# Altium schematic sheet Sheet1.SchDoc
size A1; SheetNumber: 1; SheetTotal: 1
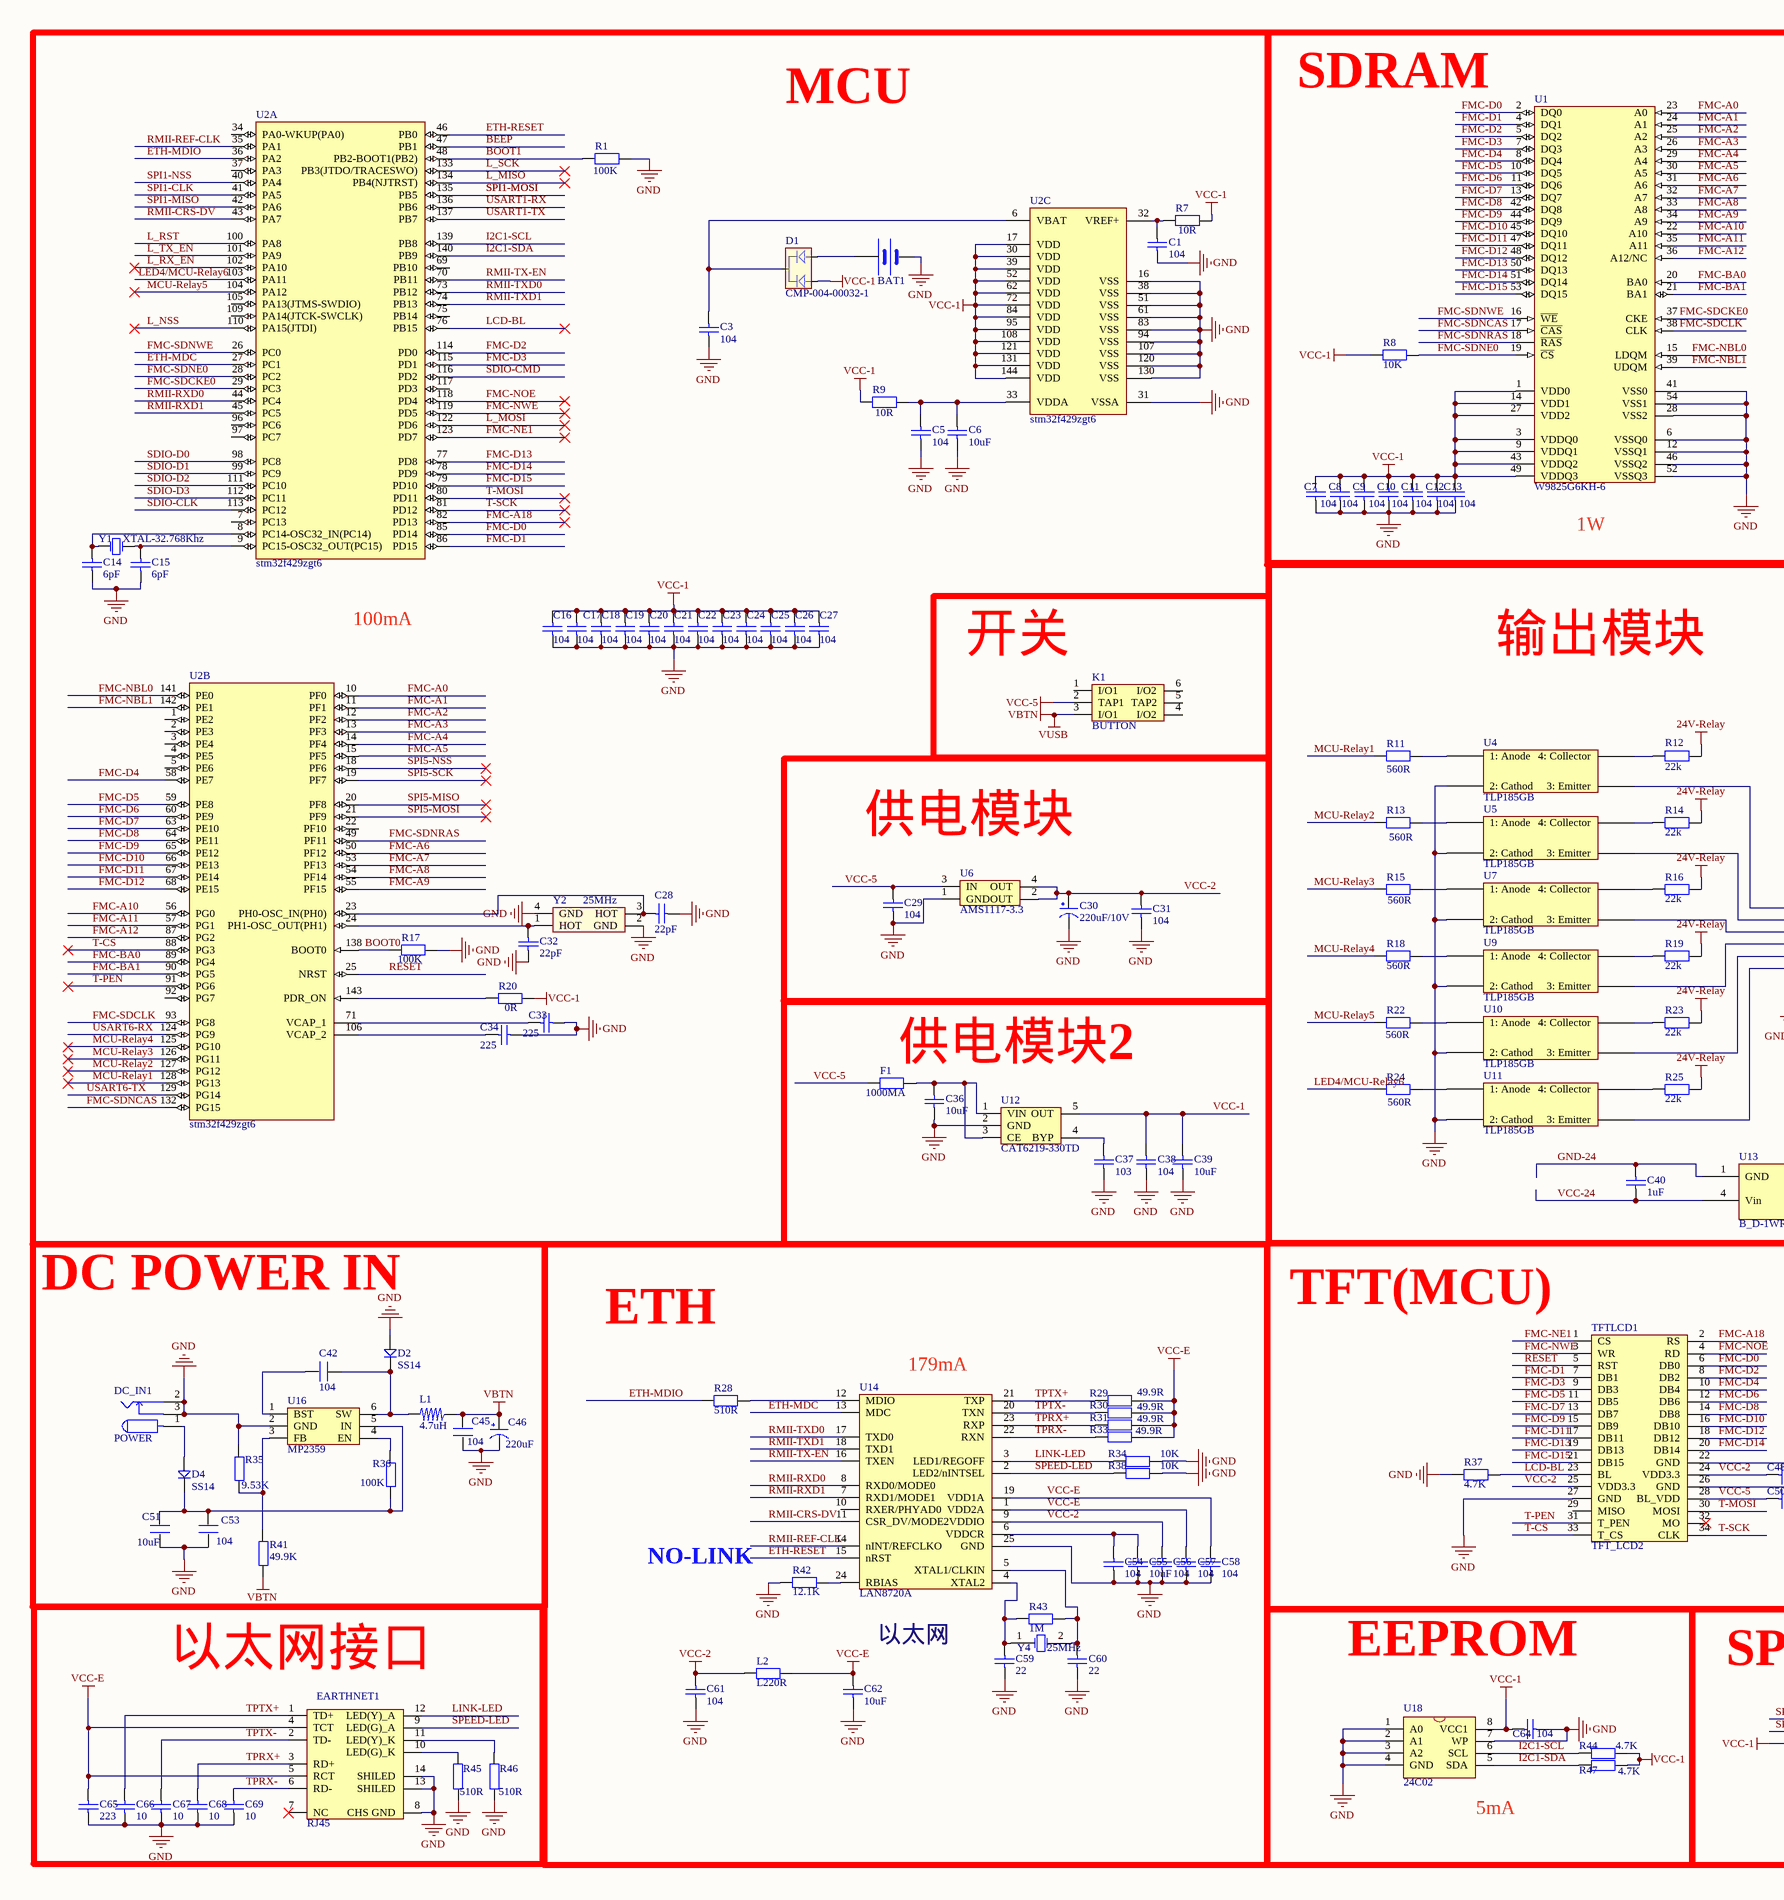
[diagram p0: Sheet1.SchDoc, left]
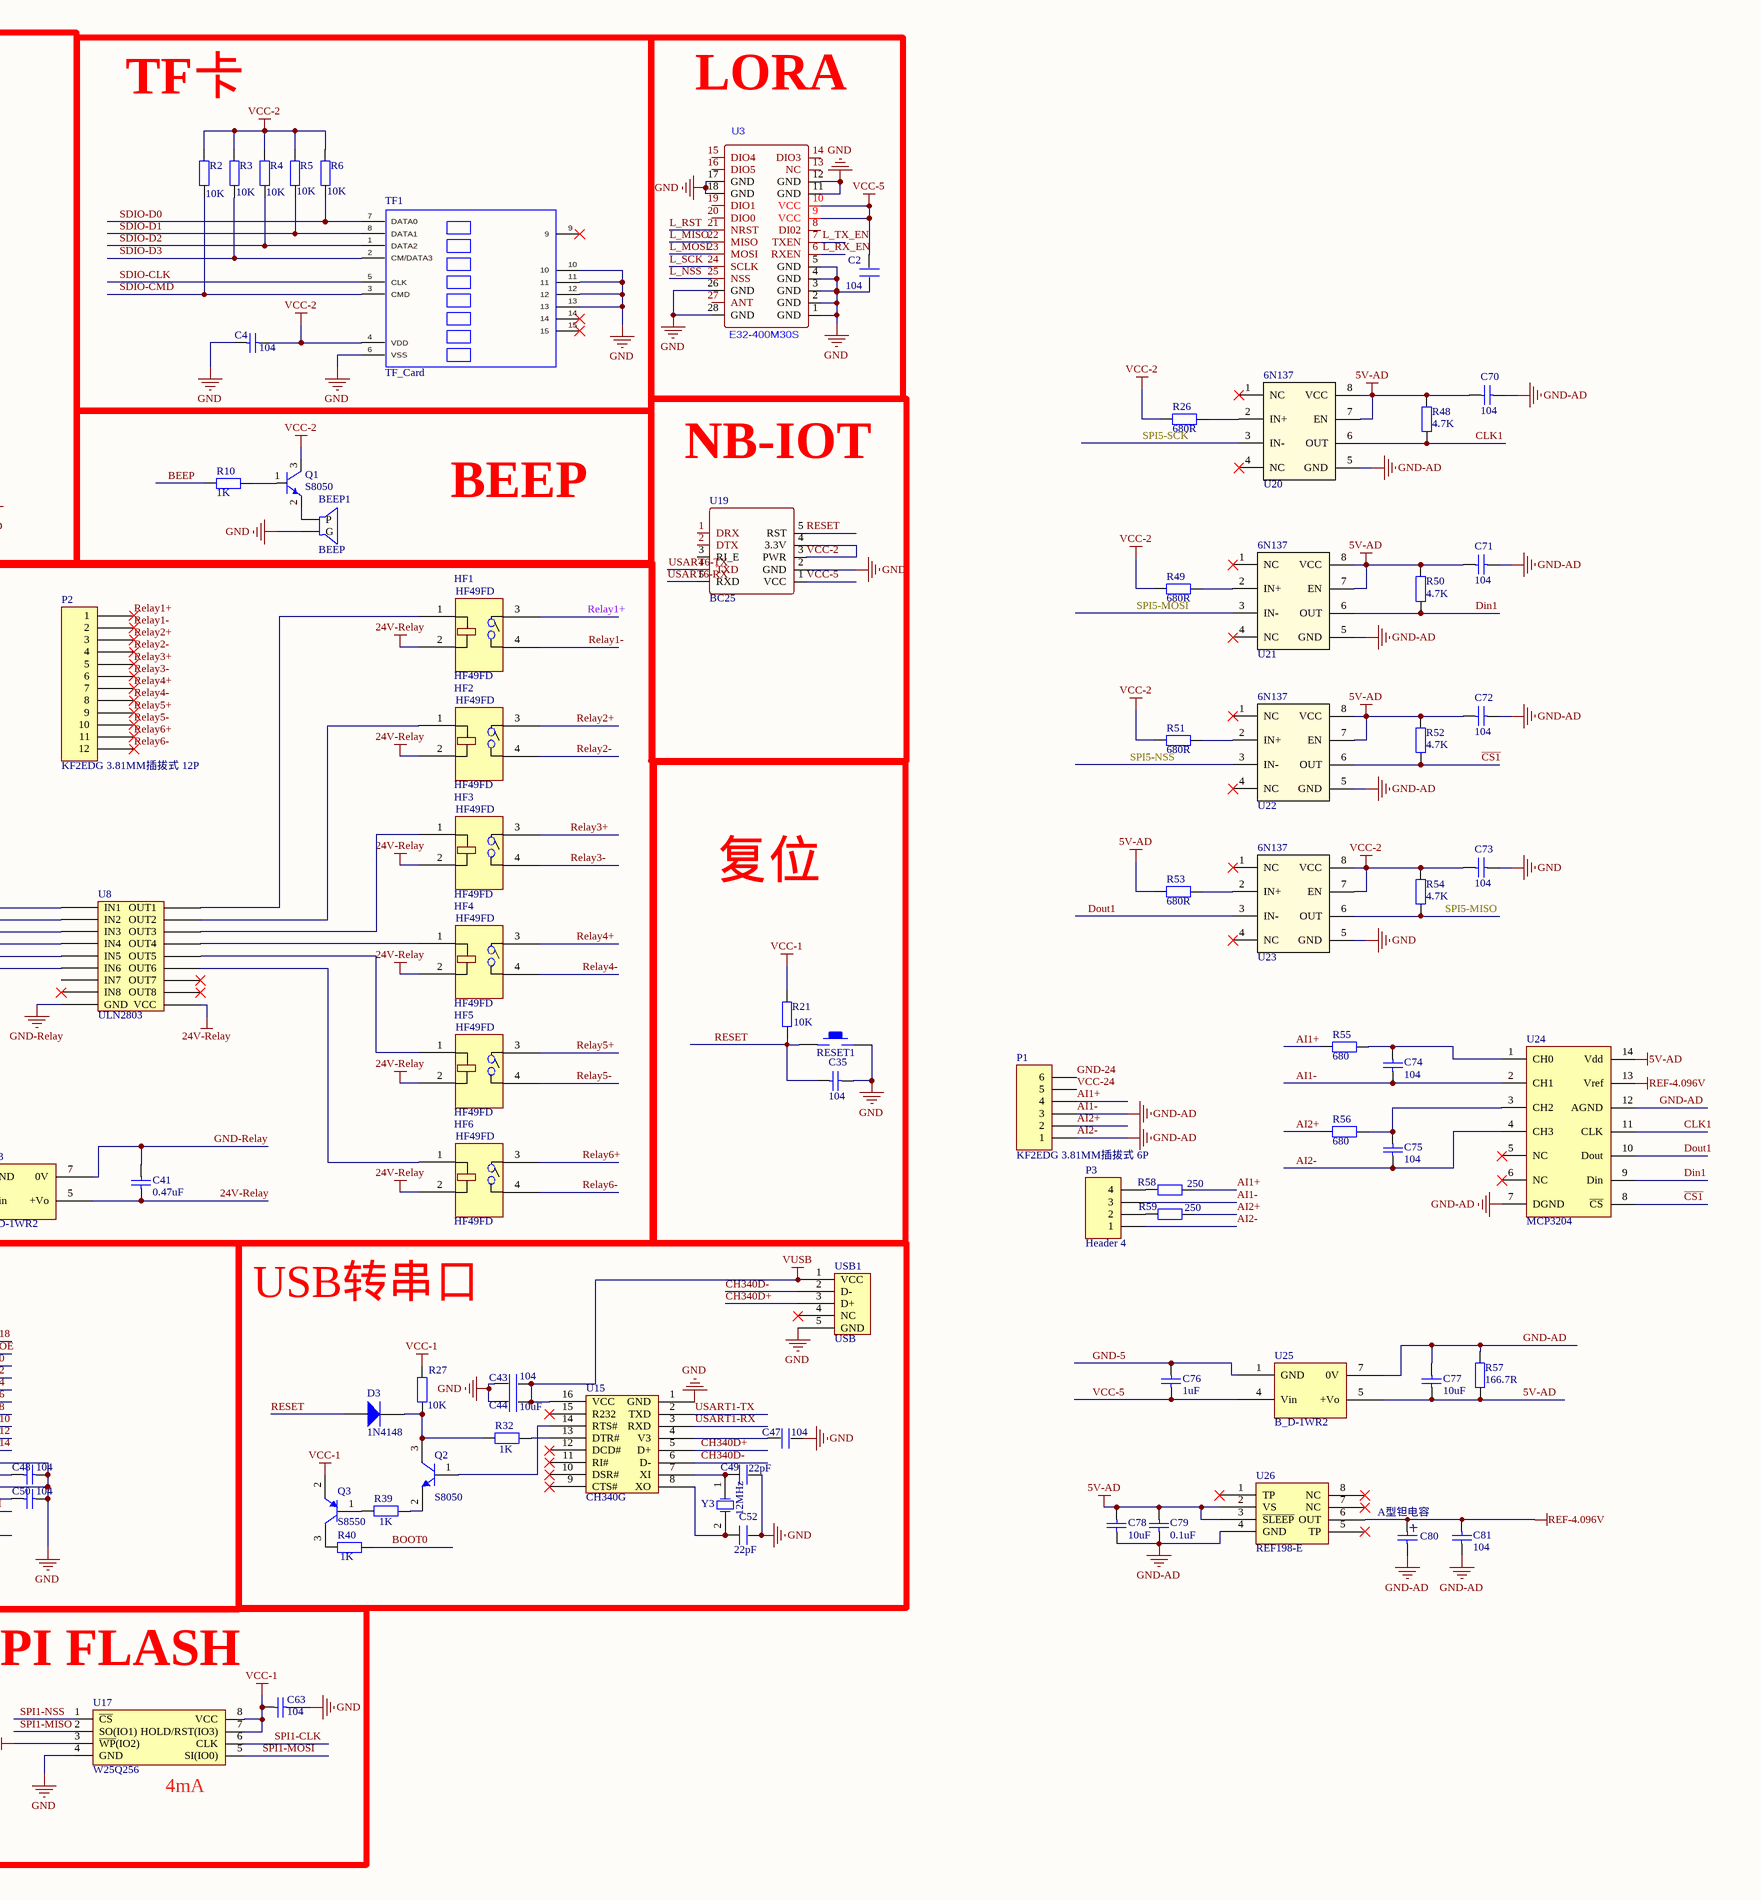
[diagram p1: Sheet1.SchDoc, right]

## Parts
BAT1  CMP-00029-00001-1  [BATM]  (value not drawn)
BEEP1  BEEP  [BELL-5]
C1  value 104  [LC-0603_C]  (hidden comment: CAP)
C2  104  [0603P]
C3  value 104  [LC-0603_C]  (hidden comment: CAP)
C4  value 104  [CAP]  (hidden comment: CMP-001-00083-1)
C5  value 104  [LC-0603_C]  (hidden comment: CAP)
C6  value 10uF  [LC-0603_C]  (hidden comment: CMP-001-00083-1)
C7  value 104  [LC-0603_C]  (hidden comment: CAP)
C8  value 104  [LC-0603_C]  (hidden comment: CAP)
C9  value 104  [LC-0603_C]  (hidden comment: CAP)
C10  value 104  [LC-0603_C]  (hidden comment: CAP)
C11  value 104  [LC-0603_C]  (hidden comment: CAP)
C12  value 104  [LC-0603_C]  (hidden comment: CAP)
C13  value 104  [LC-0603_C]  (hidden comment: CAP)
C14  value 6pF  [LC-0603_C]  (hidden comment: CMP-001-00083-1)
C15  value 6pF  [LC-0603_C]  (hidden comment: CMP-001-00083-1)
C16  value 104  [LC-0603_C]  (hidden comment: CMP-001-00083-1)
C17  value 104  [LC-0603_C]  (hidden comment: CMP-001-00083-1)
C18  value 104  [LC-0603_C]  (hidden comment: CAP)
C19  value 104  [LC-0603_C]  (hidden comment: CAP)
C20  value 104  [LC-0603_C]  (hidden comment: CAP)
C21  value 104  [LC-0603_C]  (hidden comment: CAP)
C22  value 104  [LC-0603_C]  (hidden comment: CAP)
C23  value 104  [LC-0603_C]  (hidden comment: CAP)
C24  104  [LC-0603_C]
C25  value 104  [LC-0603_C]  (hidden comment: CAP)
C26  value 104  [LC-0603_C]  (hidden comment: CAP)
C27  value 104  [LC-0603_C]  (hidden comment: CAP)
C28  value 22pF  [LC-0603_C]  (hidden comment: CMP-001-00083-1)
C29  value 104  [CAP]  (hidden comment: CMP-001-00083-1)
C30  220uF/10V  [220uF/10V]
C31  value 104  [CAP]  (hidden comment: CMP-001-00083-1)
C32  value 22pF  [LC-0603_C]  (hidden comment: CMP-001-00083-1)
C33  value 225  [LC-0603_C]  (hidden comment: CMP-001-00083-1)
C34  value 225  [LC-0603_C]  (hidden comment: CMP-001-00083-1)
C35  value 104  [LC-0603_C]  (hidden comment: CAP)
C36  value 10uF  [LC-0603_C]  (hidden comment: CMP-001-00083-1)
C37  value 103  [CAP]  (hidden comment: CMP-001-00083-1)
C38  value 104  [CAP]  (hidden comment: CMP-001-00083-1)
C39  value 10uF  [LC-0603_C]  (hidden comment: CMP-001-00083-1)
C40  value 1uF  [CAP]  (hidden comment: CMP-001-00083-1)
C41  value 0.47uF  [CAP]  (hidden comment: CMP-001-00083-1)
C42  104  [0603P]
C43  104  [0603P]
C44  10uF  [0603P]
C45  104  [0603P]
C46  220uF  [CC6.56.5]
C47  104  [0603P]
C48  value 104  [CAP]  (hidden comment: CMP-001-00083-1)
C49  22pF  [0603P]
C50  value 104  [CAP]  (hidden comment: CMP-001-00083-1)
C51  10uF  [0603P]
C52  22pF  [0603P]
C53  104  [0603P]
C54  value 104  [LC-0603_C]  (hidden comment: CAP)
C55  value 10uF  [LC-0603_C]  (hidden comment: CMP-001-00083-1)
C56  value 104  [LC-0603_C]  (hidden comment: CAP)
C57  value 104  [LC-0603_C]  (hidden comment: CAP)
C58  value 104  [LC-0603_C]  (hidden comment: CAP)
C59  value 22  [LC-0603_C]  (hidden comment: CMP-001-00083-1)
C60  value 22  [LC-0603_C]  (hidden comment: CMP-001-00083-1)
C61  value 104  [CAP]  (hidden comment: CMP-001-00083-1)
C62  value 10uF  [LC-0603_C]  (hidden comment: CMP-001-00083-1)
C63  value 104  [CAP]  (hidden comment: CMP-001-00083-1)
C64  value 104  [CAP]  (hidden comment: CMP-001-00083-1)
C65  value 223  [CAP]  (hidden comment: CMP-001-00083-1)
C66  value 10  [CAP]  (hidden comment: CMP-001-00083-1)
C67  value 10  [CAP]  (hidden comment: CMP-001-00083-1)
C68  value 10  [CAP]  (hidden comment: CMP-001-00083-1)
C69  value 10  [CAP]  (hidden comment: CMP-001-00083-1)
C70  value 104  [CAP]  (hidden comment: CAP)
C71  value 104  [CAP]  (hidden comment: CAP)
C72  value 104  [CAP]  (hidden comment: CAP)
C73  value 104  [CAP]  (hidden comment: CAP)
C74  value 104  [CAP]  (hidden comment: CAP)
C75  value 104  [CAP]  (hidden comment: CAP)
C76  value 1uF  [CAP]  (hidden comment: CMP-001-00083-1)
C77  value 10uF  [CAP]  (hidden comment: CMP-001-00083-1)
C78  value 10uF  [CAP]  (hidden comment: CAP)
C79  value 0.1uF  [CAP]  (hidden comment: CAP)
C80  A型钽电容  [A型贴片钽电容]
C81  value 104  [CAP]  (hidden comment: CAP)
D1  CMP-004-00032-1  [SOT-23]
D2  SS14  [DIODE_3*5.3]
D3  1N4148  [3.2X1.6X1.1]
D4  SS14  [DIODE_3*5.3]
DC_IN1  POWER  [DC10B]
EARTHNET1  RJ45  [HR911105A]
F1  value 1000MA  [RES]  (hidden comment: CMP-009-00177-1)
HF1  HF49FD  [HF49FDXXX_1HX1]
HF2  HF49FD  [HF49FDXXX_1HX1]
HF3  HF49FD  [HF49FDXXX_1HX1]
HF4  HF49FD  [HF49FDXXX_1HX1]
HF5  HF49FD  [HF49FDXXX_1HX1]
HF6  HF49FD  [HF49FDXXX_1HX1]
K1  BUTTON  [BTN8.5*8.5]
L1  4.7uH  [L_SOP74]
L2  L220R  [RES]
P1  KF2EDG 3.81MM插拔式 6P  [KF2EDG 3.81MM拔插]
P2  KF2EDG 3.81MM插拔式 12P  [KF2EDG 3.81mm插拔式]
P3  Header 4  [HDR1X4]
Q1  S8050  [NPN/PNP]
Q2  S8050  [SOT-23_N]
Q3  S8550  [SOT-23B_N]
R1  value 100K  [LC-0603_R]  (hidden comment: CMP-009-00177-1)
R2  10K  [RES]
R3  10K  [RES]
R4  10K  [RES]
R5  10K  [RES]
R6  10K  [RES]
R7  value 10R  [LC-0603_R]  (hidden comment: CMP-009-00177-1)
R8  10K  [LC-0603_R]
R9  value 10R  [LC-0603_R]  (hidden comment: CMP-009-00177-1)
R10  1K  [RES]
R11  value 560R  [RES]  (hidden comment: RES)
R12  value 22k  [RES]  (hidden comment: CMP-009-00180-1)
R13  value 560R  [RES]  (hidden comment: RES)
R14  value 22k  [RES]  (hidden comment: CMP-009-00180-1)
R15  value 560R  [RES]  (hidden comment: RES)
R16  value 22k  [RES]  (hidden comment: CMP-009-00180-1)
R17  value 100K  [LC-0603_R]  (hidden comment: CMP-009-00177-1)
R18  value 560R  [RES]  (hidden comment: RES)
R19  value 22k  [RES]  (hidden comment: CMP-009-00180-1)
R20  value 0R  [RES]  (hidden comment: CMP-009-00177-1)
R21  10K  [LC-0603_R]
R22  value 560R  [RES]  (hidden comment: RES)
R23  value 22k  [RES]  (hidden comment: CMP-009-00180-1)
R24  value 560R  [RES]  (hidden comment: RES)
R25  value 22k  [RES]  (hidden comment: CMP-009-00180-1)
R26  value 680R  [RES]  (hidden comment: RES)
R27  10K  [0805R]
R28  510R  [LC-0603_R]
R29  49.9R  [LC-0603_R]
R30  49.9R  [LC-0603_R]
R31  49.9R  [LC-0603_R]
R32  1K  [0805R]
R33  49.9R  [LC-0603_R]
R34  10K  [LC-0603_R]
R35  9.53K  [0603P]
R36  100K  [0603P]
R37  value 4.7K  [RES]  (hidden comment: CMP-009-00180-1)
R38  10K  [LC-0603_R]
R39  1K  [0805R]
R40  1K  [0805R]
R41  49.9K  [0603P]
R42  12.1K  [LC-0603_R]
R43  1M  [LC-0603_R]
R44  value 4.7K  [RES]  (hidden comment: CMP-009-00180-1)
R45  510R  [RES]
R46  510R  [RES]
R47  4.7K  [RES]
R48  value 4.7K  [RES]  (hidden comment: RES)
R49  value 680R  [RES]  (hidden comment: RES)
R50  value 4.7K  [RES]  (hidden comment: RES)
R51  value 680R  [RES]  (hidden comment: RES)
R52  value 4.7K  [RES]  (hidden comment: RES)
R53  value 680R  [RES]  (hidden comment: RES)
R54  value 4.7K  [RES]  (hidden comment: RES)
R55  value 680  [RES]  (hidden comment: RES)
R56  value 680  [RES]  (hidden comment: RES)
R57  value 166.7R  [1206_R]  (hidden comment: CMP-009-00180-1)
R58  value 250  [1206_R]  (hidden comment: CMP-009-00180-1)
R59  value 250  [1206_R]  (hidden comment: CMP-009-00180-1)
RESET1  CMP-012-000013-1  [KEY_M]  (value not drawn)
TF1  TF_Card  [TF_CARD]
TFTLCD1  TFT_LCD2  [DB2*17-3.5]
U1  W9825G6KH-6  [TSOP54]
U2  stm32f429zgt6  [STM-LQFP144_N]  (parts A,B,C of 3)
U3  E32-400M30S  [WIRELM-SMD_E32-400M30S]
U4  TLP185GB  [TLP185GB]
U5  TLP185GB  [TLP185GB]
U6  AMS1117-3.3  [AMS1117]
U7  TLP185GB  [TLP185GB]
U8  ULN2803  [ULN2803]
U9  TLP185GB  [TLP185GB]
U10  TLP185GB  [TLP185GB]
U11  TLP185GB  [TLP185GB]
U12  CAT6219-330TD  [SOT-23-5]
U13  B_D-1WR2  [B_D-1WR2]
U14  LAN8720A  [QFN24]
U15  CH340G  [CH340]
U16  MP2359  [SOT-23-6]
U17  W25Q256  [WSON8]
U18  24C02  [SOP-8]
U19  BC25  [BC28]
U20  6N137  [6N137]  (value not drawn)
U21  6N137  [6N137]  (value not drawn)
U22  6N137  [6N137]  (value not drawn)
U23  6N137  [6N137]  (value not drawn)
U24  MCP3204  [MCP3204]
U25  B_D-1WR2  [B_D-1WR2]
U26  REF198-E  [REF198]
USB1  USB  [USB-mirco]
Y1  XTAL-32.768Khz  [XTAL3215]
Y2  25MHz  [XTAL3225]
Y3  12MHz  [插针二脚晶振]
Y4  25MHz  [XTAL_US]

## Blocks framed on the sheet
MCU: BAT1 C1 C3 C5 C6 C14-C28 C32-C34 D1 R1 R7 R9 R17 R20 U2 Y1 Y2
SDRAM: C7-C13 R8 U1
TF卡: C4 R2-R6 TF1
LORA: C2 U3
NB-IOT: U19
BEEP: BEEP1 Q1 R10
输出模块: C40 C41 HF1-HF6 P2 R11-R16 R18 R19 R22-R25 U4 U5 U7-U11 U13
开关: K1
供电模块: C29-C31 U6
复位: C35 R21 RESET1
供电模块2: C36-C39 F1 U12
DC POWER IN: C42 C45 C46 C51 C53 D2 D4 DC_IN1 L1 R35 R36 R41 U16
ETH: C54-C62 L2 R28-R31 R33 R34 R38 R42 R43 U14 Y4
TFT(MCU): C48 C50 R37 TFTLCD1
USB转串口: C43 C44 C47 C49 C52 D3 Q2 Q3 R27 R32 R39 R40 U15 USB1 Y3
以太网接口: C65-C69 EARTHNET1 R45 R46
EEPROM: C64 R44 R47 U18
SPI FLASH: C63 U17

## Nets
5V-AD: C70.1 C71.1 C72.1 C77.1 C78.2 C79.2 R48.2 R50.2 R52.2 R53.1 R57.1 U20.7(EN) U20.8(VCC) U21.7(EN) U21.8(VCC) U22.7(EN) U22.8(VCC) U24.14(Vdd) U25.5(+Vo) U26.2(VS) U26.3(~{SLEEP})
24V-Relay: C41.1 HF1.2 HF2.2 HF3.2 HF4.2 HF5.2 HF6.2 R12.2 R14.2 R16.2 R19.2 R23.2 R25.2 U8.10(VCC) U13.5(+Vo)
AI1-: C70.2 C71.2 C72.2 C74.1 C75.1 C77.2 C78.1 C79.1 C80.2 C81.1 P1.1 P1.3 P3.1 P3.3 R57.2 U20.5(GND) U21.5(GND) U22.5(GND) U24.2(CH1) U24.4(CH3) U24.7(DGND) U24.12(AGND) U25.7(0V) U26.4(GND)  [also labelled AI2-, GND-AD]
GND: BAT1.2(GND) BEEP1.2(G) C1.1 C2.1 C3.1 C4.1 C5.1 C6.1 C7.1 C8.1 C9.1 C10.1 C11.1 C12.1 C13.1 C14.1 C15.1 C16.1 C17.1 C18.1 C19.1 C20.1 C21.1 C22.1 C23.1 C24.1 C25.1 C26.1 C27.1 C28.1 C29.1 C30.2(GND) C31.1 C32.1 C33.1 C34.1 C35.2 C36.1 C37.1 C38.1 C39.1 C43.1 C44.1 C45.1 C46.2(GND) C47.2 C48.2 C49.1 C50.2 C51.1 C52.1 C53.1 C54.1 C55.1 C56.1 C57.1 C58.1 C59.1 C60.1 C61.1 C62.1 C63.2 C64.2 C65.1 C66.1 C67.1 C68.1 C69.1 C73.2 D2.1 DC_IN1.2 DC_IN1.3 EARTHNET1.8(CHS_GND) EARTHNET1.13(SHILED) EARTHNET1.14(SHILED) R1.1 R17.2 R34.2 R35.2 R37.1 R38.2 R42.1 R45.1 R46.1 RESET1.2 TF1.6(VSS) TF1.10 TF1.11 TF1.12 TF1.13 TFTLCD1.22(GND) TFTLCD1.26(GND) TFTLCD1.27(GND) U1.6(VSSQ0) U1.12(VSSQ1) U1.28(VSS2) U1.41(VSS0) U1.46(VSSQ2) U1.52(VSSQ3) U1.54(VSS1) U2.16(VSS) U2.31(VSSA) U2.38(VSS) U2.51(VSS) U2.61(VSS) U2.83(VSS) U2.94(VSS) U2.107(VSS) U2.120(VSS) U2.130(VSS) U3.1(GND) U3.2(GND) U3.3(GND) U3.4(GND) U3.5(GND) U3.11(GND) U3.12(GND) U3.17(GND) U3.18(GND) U3.26(GND) U3.28(GND) U4.2(2:_Cathod) U5.2(2:_Cathod) U6.1(GND) U7.2(2:_Cathod) U9.2(2:_Cathod) U10.2(2:_Cathod) U11.2(2:_Cathod) U12.2(GND) U14.25(GND) U15.1(GND) U16.2(GND) U17.4(GND) U18.1(A0) U18.2(A1) U18.3(A2) U18.4(GND) U18.7(WP) U19.2(GND) U23.5(GND) USB1.5(GND) Y2.2(GND) Y2.4(GND)
GND-Relay: C41.2 U8.9(GND) U13.7(0V)
REF-4.096V: C80.1 C81.2 U24.13(Vref) U26.6(OUT)
VBTN: C43.2 C44.2 C45.2 C46.1(VCC) K1.3(I/O1) L1.1 R41.1 U15.16(VCC) USB1.1(VCC)  [also labelled VUSB]
VCC-1: C7.2 C8.2 C9.2 C10.2 C11.2 C12.2 C13.2 C16.2 C17.2 C18.2 C19.2 C20.2 C21.2 C22.2 C23.2 C24.2 C25.2 C26.2 C27.2 C38.2 C39.2 C63.1 C64.1 D1.1 Q3.2(E) R7.2 R8.1 R9.1 R20.1 R21.2 R27.2 R44.2 R47.2 U1.1(VDD0) U1.3(VDDQ0) U1.9(VDDQ1) U1.14(VDD1) U1.27(VDD2) U1.43(VDDQ2) U1.49(VDDQ3) U2.17(VDD) U2.30(VDD) U2.39(VDD) U2.52(VDD) U2.62(VDD) U2.72(VDD) U2.84(VDD) U2.95(VDD) U2.108(VDD) U2.121(VDD) U2.131(VDD) U2.144(VDD) U12.5(OUT) U17.3(~{WP}(IO2)) U17.7(HOLD/RST(IO3)) U17.8(VCC) U18.8(VCC1)
VCC-2: C4.2 C30.1(VCC) C31.2 C48.1 C56.2 C61.2 C73.1 L2.1 Q1.3 R2.2 R3.2 R4.2 R5.2 R6.2 R26.1 R49.1 R51.1 R54.2 TF1.4(VDD) TFTLCD1.24(VDD3.3) TFTLCD1.25(VDD3.3) U6.2(OUT) U6.4(OUT) U14.9(VDDIO) U19.3(PWR) U19.4(3.3V) U23.7(EN) U23.8(VCC)
VCC-5: C2.2 C29.2 C50.1 C76.1 F1.1 K1.2(TAP1) TFTLCD1.28(BL_VDD) U3.9(VCC) U3.10(VCC) U6.3(IN) U19.1(VCC) U25.4(Vin)
VCC-E: C57.2 C58.2 C62.2 C65.2 EARTHNET1.4(TCT) EARTHNET1.5(RCT) L2.2 R29.2 R30.2 R31.2 R33.2 U14.1(VDD2A) U14.19(VDD1A)
AI1+: P1.4 R55.1 R58.1
AI2+: P1.2 R56.1 R59.1
BEEP: R10.1 U2.47(PB1)
BOOT0: R17.1 R40.1 U2.138(BOOT0)
BOOT1: R1.2 U2.48(PB2-BOOT1(PB2))
~{CS1}: R52.1 U22.6(OUT) U24.8(~{CS})
CH340D+: U15.5(D+) USB1.3(D+)
CH340D-: U15.6(D-) USB1.2(D-)
CLK1: R48.1 U20.6(OUT) U24.11(CLK)
Din1: R50.1 U21.6(OUT) U24.9(Din)
Dout1: U23.3(IN-) U24.10(Dout)
ETH-MDC: U2.27(PC1) U14.13(MDC)
ETH-MDIO: R28.1 U2.36(PA2)
ETH-RESET: U2.46(PB0) U14.15(nRST)
FMC-A0: U1.23(A0) U2.10(PF0)
FMC-A1: U1.24(A1) U2.11(PF1)
FMC-A2: U1.25(A2) U2.12(PF2)
FMC-A3: U1.26(A3) U2.13(PF3)
FMC-A4: U1.29(A4) U2.14(PF4)
FMC-A5: U1.30(A5) U2.15(PF5)
FMC-A6: U1.31(A6) U2.50(PF12)
FMC-A7: U1.32(A7) U2.53(PF13)
FMC-A8: U1.33(A8) U2.54(PF14)
FMC-A9: U1.34(A9) U2.55(PF15)
FMC-A10: U1.22(A10) U2.56(PG0)
FMC-A11: U1.35(A11) U2.57(PG1)
FMC-A12: U1.36(A12/NC) U2.87(PG2)
FMC-A18: TFTLCD1.2(RS) U2.82(PD13)
FMC-BA0: U1.20(BA0) U2.89(PG4)
FMC-BA1: U1.21(BA1) U2.90(PG5)
FMC-D0: TFTLCD1.6(DB0) U1.2(DQ0) U2.85(PD14)
FMC-D1: TFTLCD1.7(DB1) U1.4(DQ1) U2.86(PD15)
FMC-D2: TFTLCD1.8(DB2) U1.5(DQ2) U2.114(PD0)
FMC-D3: TFTLCD1.9(DB3) U1.7(DQ3) U2.115(PD1)
FMC-D4: TFTLCD1.10(DB4) U1.8(DQ4) U2.58(PE7)
FMC-D5: TFTLCD1.11(DB5) U1.10(DQ5) U2.59(PE8)
FMC-D6: TFTLCD1.12(DB6) U1.11(DQ6) U2.60(PE9)
FMC-D7: TFTLCD1.13(DB7) U1.13(DQ7) U2.63(PE10)
FMC-D8: TFTLCD1.14(DB8) U1.42(DQ8) U2.64(PE11)
FMC-D9: TFTLCD1.15(DB9) U1.44(DQ9) U2.65(PE12)
FMC-D10: TFTLCD1.16(DB10) U1.45(DQ10) U2.66(PE13)
FMC-D11: TFTLCD1.17(DB11) U1.47(DQ11) U2.67(PE14)
FMC-D12: TFTLCD1.18(DB12) U1.48(DQ12) U2.68(PE15)
FMC-D13: TFTLCD1.19(DB13) U1.50(DQ13) U2.77(PD8)
FMC-D14: TFTLCD1.20(DB14) U1.51(DQ14) U2.78(PD9)
FMC-D15: TFTLCD1.21(DB15) U1.53(DQ15) U2.79(PD10)
FMC-NBL0: U1.15(LDQM) U2.141(PE0)
FMC-NBL1: U1.39(UDQM) U2.142(PE1)
FMC-NE1: TFTLCD1.1(CS) U2.123(PD7)
FMC-NOE: TFTLCD1.4(RD) U2.118(PD4)
FMC-NWE: TFTLCD1.3(WR) U2.119(PD5)
FMC-SDCKE0: U1.37(CKE) U2.29(PC3)
FMC-SDCLK: U1.38(CLK) U2.93(PG8)
FMC-SDNCAS: U1.17(~{CAS}) U2.132(PG15)
FMC-SDNE0: R8.2 U1.19(~{CS}) U2.28(PC2)
FMC-SDNRAS: U1.18(~{RAS}) U2.49(PF11)
FMC-SDNWE: U1.16(~{WE}) U2.26(PC0)
GND-5: C76.2 U25.1(GND)
GND-24: C40.2 P1.6 U13.1(GND)
I2C1-SCL: R44.1 U2.139(PB8) U18.6(SCL)
I2C1-SDA: R47.1 U2.140(PB9) U18.5(SDA)
L_MISO: U2.134(PB4(NJTRST)) U3.22(MISO)
L_MOSI: U2.122(PD6) U3.23(MOSI)
L_NSS: U2.110(PA15(JTDI)) U3.25(NSS)
L_RST: U2.100(PA8) U3.21(NRST)
L_RX_EN: U2.102(PA10) U3.6(RXEN)
L_SCK: U2.133(PB3(JTDO/TRACESWO)) U3.24(SCLK)
L_TX_EN: U2.101(PA9) U3.7(TXEN)
LCD-BL: R37.2 TFTLCD1.23(BL) U2.76(PB15)
LED4/MCU-Relay6: R24.1 U2.103(PA11)
LINK-LED: EARTHNET1.12(LED(Y)_A) R34.1 U14.3(LED1/REGOFF)
MCU-Relay1: R11.1 U2.128(PG13)
MCU-Relay2: R13.1 U2.127(PG12)
MCU-Relay3: R15.1 U2.126(PG11)
MCU-Relay4: R18.1 U2.125(PG10)
MCU-Relay5: R22.1 U2.104(PA12)
Relay1+: HF1.3 P2.1
Relay1-: HF1.4 P2.2
Relay2+: HF2.3 P2.3
Relay2-: HF2.4 P2.4
Relay3+: HF3.3 P2.5
Relay3-: HF3.4 P2.6
Relay4+: HF4.3 P2.7
Relay4-: HF4.4 P2.8
Relay5+: HF5.3 P2.9
Relay5-: HF5.4 P2.10
Relay6+: HF6.3 P2.11
Relay6-: HF6.4 P2.12
RESET: C35.1 D3.1(A) R21.1 RESET1.1 TFTLCD1.5(RST) U2.25(NRST) U19.5(RST)
RMII-CRS-DV: U2.43(PA7) U14.11(CSR_DV/MODE2)
RMII-REF-CLK: U2.35(PA1) U14.14(nINT/REFCLKO)
RMII-RXD0: U2.44(PC4) U14.8(RXD0/MODE0)
RMII-RXD1: U2.45(PC5) U14.7(RXD1/MODE1)
RMII-TX-EN: U2.70(PB11) U14.16(TXEN)
RMII-TXD0: U2.73(PB12) U14.17(TXD0)
RMII-TXD1: U2.74(PB13) U14.18(TXD1)
SDIO-CLK: TF1.5(CLK) U2.113(PC12)
SDIO-CMD: R2.1 TF1.3(CMD) U2.116(PD2)
SDIO-D0: R6.1 TF1.7(DATA0) U2.98(PC8)
SDIO-D1: R5.1 TF1.8(DATA1) U2.99(PC9)
SDIO-D2: R4.1 TF1.1(DATA2) U2.111(PC10)
SDIO-D3: R3.1 TF1.2(CM/DATA3) U2.112(PC11)
SPEED-LED: EARTHNET1.9(LED(G)_A) R38.1 U14.2(LED2/nINTSEL)
SPI1-CLK: U2.41(PA5) U17.6(CLK)
SPI1-MISO: U2.42(PA6) U17.2(SO(IO1))
SPI1-MOSI: U2.135(PB5) U17.5(SI(IO0))
SPI1-NSS: U2.40(PA4) U17.1(~{CS})
SPI5-MISO: R54.1 U2.20(PF8) U23.6(OUT)
SPI5-MOSI: U2.21(PF9) U21.3(IN-)
SPI5-NSS: U2.18(PF6) U22.3(IN-)
SPI5-SCK: U2.19(PF7) U20.3(IN-)
T-CS: TFTLCD1.33(T_CS) U2.88(PG3)
T-MOSI: TFTLCD1.30(MOSI) U2.80(PD11)
T-PEN: TFTLCD1.31(T_PEN) U2.91(PG6)
T-SCK: TFTLCD1.34(CLK) U2.81(PD12)
TPRX+: C68.2 EARTHNET1.3(RD+) R31.1 U14.23(RXP)
TPRX-: C69.2 EARTHNET1.6(RD-) R33.1 U14.22(RXN)
TPTX+: C66.2 EARTHNET1.1(TD+) R29.1 U14.21(TXP)
TPTX-: C67.2 EARTHNET1.2(TD-) R30.1 U14.20(TXN)
USART1-RX: U2.136(PB6) U15.3(RXD)
USART1-TX: U2.137(PB7) U15.2(TXD)
USART6-RX: U2.124(PG9) U19.5(RXD)
USART6-TX: U2.129(PG14) U19.4(TXD)
VCC-24: C40.1 P1.5 U13.4(Vin)
NetBAT1_1: BAT1.1(VCC) D1.2
NetBEEP1_1: BEEP1.1(P) Q1.2
NetC1_2: C1.2 R7.1 U2.32(VREF+)
NetC3_2: C3.2 D1.3 U2.6(VBAT)
NetC5_2: C5.2 C6.2 R9.2 U2.33(VDDA)
NetC14_2: C14.2 U2.8(PC14-OSC32_IN(PC14)) Y1.1(OSC1)
NetC15_2: C15.2 U2.9(PC15-OSC32_OUT(PC15)) Y1.2(OSC2)
NetC28_2: C28.2 U2.23(PH0-OSC_IN(PH0)) Y2.3(HOT)
NetC32_2: C32.2 U2.24(PH1-OSC_OUT(PH1)) Y2.1(HOT)
NetC33_2: C33.2 U2.71(VCAP_1)
NetC34_2: C34.2 U2.106(VCAP_2)
NetC36_2: C36.2 F1.2 U12.1(VIN) U12.3(CE)
NetC37_2: C37.2 U12.4(BYP)
NetC42_1: C42.1 D2.2 L1.2 U16.6(SW)
NetC42_2: C42.2 U16.1(BST)
NetC47_1: C47.1 U15.4(V3)
NetC49_2: C49.2 U15.7(XI) Y3.1(OSC1)
NetC51_2: C51.2 C53.2 D4.2 R36.1 U16.5(IN)
NetC52_2: C52.2 U15.8(XO) Y3.2(OSC2)
NetC54_2: C54.2 C55.2 U14.6(VDDCR)
NetC59_2: C59.2 R43.1 U14.4(XTAL2) Y4.1(OSC1)
NetC60_2: C60.2 R43.2 U14.5(XTAL1/CLKIN) Y4.2(OSC2)
NetC74_2: C74.2 R55.2 U24.1(CH0)
NetC75_2: C75.2 R56.2 U24.3(CH2)
NetD3_2: D3.2(K) Q2.3(C) R27.1 R32.1
NetD4_1: D4.1 DC_IN1.1
NetEARTHNET1_10: EARTHNET1.10(LED(G)_K) R45.2
NetEARTHNET1_11: EARTHNET1.11(LED(Y)_K) R46.2
NetHF1_1: HF1.1 U8.18(OUT1)
NetHF2_1: HF2.1 U8.17(OUT2)
NetHF3_1: HF3.1 U8.16(OUT3)
NetHF4_1: HF4.1 U8.15(OUT4)
NetHF5_1: HF5.1 U8.14(OUT5)
NetHF6_1: HF6.1 U8.13(OUT6)
NetP3_2: P3.2 R59.2
NetP3_4: P3.4 R58.2
NetQ1_1: Q1.1 R10.2
NetQ2_1: Q2.1(B) U15.14(RTS#)
NetQ2_2: Q2.2(E) R39.2
NetQ3_1: Q3.1(B) R39.1
NetQ3_3: Q3.3(C) R40.2
NetR11_2: R11.2 U4.1(1:_Anode)
NetR12_1: R12.1 U4.4(4:_Collector)
NetR13_2: R13.2 U5.1(1:_Anode)
NetR14_1: R14.1 U5.4(4:_Collector)
NetR15_2: R15.2 U7.1(1:_Anode)
NetR16_1: R16.1 U7.4(4:_Collector)
NetR18_2: R18.2 U9.1(1:_Anode)
NetR19_1: R19.1 U9.4(4:_Collector)
NetR20_2: R20.2 U2.143(PDR_ON)
NetR22_2: R22.2 U10.1(1:_Anode)
NetR23_1: R23.1 U10.4(4:_Collector)
NetR24_2: R24.2 U11.1(1:_Anode)
NetR25_1: R25.1 U11.4(4:_Collector)
NetR26_2: R26.2 U20.2(IN+)
NetR28_2: R28.2 U14.12(MDIO)
NetR32_2: R32.2 U15.13(DTR#)
NetR35_1: R35.1 R41.2 U16.3(FB)
NetR36_2: R36.2 U16.4(EN)
NetR42_2: R42.2 U14.24(RBIAS)
NetR49_2: R49.2 U21.2(IN+)
NetR51_2: R51.2 U22.2(IN+)
NetR53_2: R53.2 U23.2(IN+)
NetU4_3: U4.3(3:_Emitter) U8.1(IN1)
NetU5_3: U5.3(3:_Emitter) U8.2(IN2)
NetU7_3: U7.3(3:_Emitter) U8.3(IN3)
NetU8_4: U8.4(IN4) U9.3(3:_Emitter)
NetU8_5: U8.5(IN5) U10.3(3:_Emitter)
NetU8_6: U8.6(IN6) U11.3(3:_Emitter)

Not connected (* = marked no-connect by the designer): EARTHNET1 7(NC)*; K1 1(I/O1) 4(I/O2) 5(TAP2) 6(I/O2); TF1 9* 14* 15*; TFTLCD1 29(MISO) 32(MO)*; U2 1(PE2) 2(PE3) 3(PE4) 4(PE5) 5(PE6) 7(PC13) 22(PF10) 34(PA0-WKUP(PA0)) 37(PA3) 69(PB10) 75(PB14) 92(PG7) 96(PC6) 97(PC7) 105(PA13(JTMS-SWDIO)) 109(PA14(JTCK-SWCLK)) 117(PD3); U3 8(DI02) 13(NC) 14(DIO3) 15(DIO4) 16(DIO5) 19(DIO1) 20(DIO0) 27(ANT); U8 7(IN7) 8(IN8)* 11(OUT8)* 12(OUT7)*; U14 10(RXER/PHYAD0); U15 9(CTS#)* 10(DSR#)* 11(RI#)* 12(DCD#)* 15(R232)*; U20 1(NC)* 4(NC)*; U21 1(NC)* 4(NC)*; U22 1(NC)* 4(NC)*; U23 1(NC)* 4(NC)*; U24 5(NC)* 6(NC)*; U26 1(TP)* 5(TP)* 7(NC)* 8(NC)*; USB1 4(NC)*

## Notes on the sheet
- (near U1) 1W
- 100mA
- (near U14) 179mA
- NO-LINK
- 以太网
- (near U18) 5mA
- (near U17) 4mA

## Library data of the parts
BEEP1 = CMP-012-000005-1: Pin Count: 2; Source: Schlib2.SchLib; Design Item ID: BEEP; Component Type: Standard
C1 C3 C5 C7-C13 C18-C27 C35 C54 C56-C58 = CMP-001-00083-1: Source: Schlib2.SchLib; Design Item ID: CAP; Pins: 2; Component Type: Standard
  C24: Value: 104
C2 C42-C45 C47 C49 C51-C53 = CMP-001-00086-1: Design Item ID: C; Component Type: Standard; Source: STM32F429_F746.SCHLIB; Pins: 2
C30 = CMP-001-00084-1: Design Item ID: CAP贴片电解电容; Component Type: Standard; Source: Schlib2.SchLib
C46 = CMP-001-00087-1: Source: STM32F429_F746.SCHLIB; Component Type: Standard; Design Item ID: CAP; Pins: 2
C80 = CMP-001-00097-1: Design Item ID: A型钽电容; Component Type: Standar; Source: Schlib3.SchLib
D1 = CMP-004-00032-1: 双肖特基二极管; Source: Schlib2.SchLib; Component Type: Standard; Design Item ID: BAT54C
D2 D4 = CMP-004-00036-1: Pins: 2; Source: STM32F429_F746.SCHLIB; Design Item ID: D; Component Type: Standard
D3 = CMP-004-00039-1: Source: 主控芯片.SCHLIB; Pins: 2; Design Item ID: DIODE; Component Type: Standard
DC_IN1 = CMP-035-000026-1: Source: STM32F429_F746.SCHLIB; Design Item ID: POW; Component Type: Standard; Pin Count: 3
EARTHNET1 = CMP-012-000011-1: Component Type: Standard; Design Item ID: HR911105; Source: Schlib2.SchLib; Pin Count: 14
HF1-HF6 = CMP-040-000006-1: Design Item ID: HF49FD; Pin Count: 4; Source: 电源模块.SCHLIB; Component Type: Standard
K1 = CMP-035-000004-1: Design Item ID: BUTTON; Pin Count: 6; Source: STM32F429_F746.SCHLIB; Component Type: Standard
L1 = CMP-006-00022-1: Design Item ID: L_SOP; Component Type: Standard; Source: STM32F429_F746.SCHLIB; Pins: 2
L2 R2-R6 R8 R10 R21 R28-R31 R33 R34 R38 R42 R43 R45-R47 = CMP-009-00177-1: Pins: 2; Component Type: Standard; Source: Schlib2.SchLib; Design Item ID: RES
P1 = Header 6: Header, 6-Pin; LatestRevisionDate: 17-Jul-2002; LatestRevisionNote: Re-released for DXP Platform.; Publisher: Altium Limited
P2 = CMP-040-000007-1: Design Item ID: KF2EDG 3.81MM插拔式 12P; Component Type: Standard; Source: 电源模块.SCHLIB
P3 = CMP-002-00085-1: Header, 4-Pin; LatestRevisionNote: Re-released for DXP Platform.; LatestRevisionDate: 17-Jul-2002; Component Type: Standard; Source: STM32F429_F746.SCHLIB; Pins: 4; Publisher: Altium Limited; Design Item ID: Header 4
Q1 = CMP-012-00000-1: NPN; Pins: 3; Design Item ID: NPN; Component Type: Standard; Source: Schlib2.SchLib
Q2 = CMP-050-000014-1: Component Type: Standard; Design Item ID: QNPN; Pin Count: 3; Source: 主控芯片.SCHLIB
Q3 = CMP-050-000015-1: Component Type: Standard; Design Item ID: QPNP; Pin Count: 3; Source: 主控芯片.SCHLIB
R11 R13 R15 R18 R22 R24 = CMP-009-00180-1: Pins: 2; Component Type: Standard; Source: 电源模块.SCHLIB; Design Item ID: RES
R27 R32 R39 R40 = CMP-009-00186-1: Source: 主控芯片.SCHLIB; Component Type: Standard; Design Item ID: RES; Pins: 2
R35 R36 R41 = CMP-009-00179-1: Pins: 2; Design Item ID: R; Source: STM32F429_F746.SCHLIB; Component Type: Standard
TF1 = CMP-012-000020-1: Design Item ID: TF_Card; Pin Count: 15; Source: Schlib2.SchLib; Component Type: Standard
TFTLCD1 = CMP-055-000002-1: Pin Count: 34; Source: 显示模块.SCHLIB; Design Item ID: TFT_LCD2; Component Type: Standard
U1 = CMP-012-000012-1: 32MB SDRAM; Pin Count: 53; Design Item ID: IS42S16160B; Component Type: Standard; Source: Schlib2.SchLib
U2 = CMP-031-00009-1: ARM Cortex-M4 32-bit MCU+FPU, 225 DMIPS, 1024 kB Flash, 256 kB Internal RAM, 114 I/Os, 144-pin LQFP, -40 to 85 degC, Tray; Manufacturer: STMicroelectronics; D/A Converter: 2x12-bit; FLASH Size (Prog) (kB): 1024; I/Os (High Current): 114; Internal RAM Size (kB): 256; Operating Frequency(F) (Processor speed) (MHz): 180Hz; Supply Voltage(Vcc) max (V): 3.6; Supply Voltage(Vcc) min (V): 1.8; DatasheetVersion: Rev. 2; PackageVersion: Rev. 4, 06/2013; PackageReference: LQFP144; Core: ARM Cortex-M4; Packing: Tray; Mounting Technology: Surface Mount; PartNumber: STM32F429ZGT6; ComponentLink1Description: Manufacturer URL; ComponentLink1URL: http://www.st.com/web/en/home.html; ComponentLink2Description: Datasheet; ComponentLink2URL: http://www.st.com/st-web-ui/static/active/en/resource/technical/document/data_brief/DM00053488.pdf; ComponentLink3Description: Package Specification; ComponentLink3URL: http://www.st.com/st-web-ui/static/active/en/resource/technical/document/datasheet/DM00037051.pdf; Component Type: Standard; Case/Package: 144-Pin Low Profile Quad Flat Package, 20 x 20 mm Body, 0.5 mm Pitch; Design Item ID: STM32F429ZGT6; Source: Schlib2.SchLib; Pins: 144
U3 = CMP-024-000000-1: Component Type: Standard; Source: Schlib1.SchLib; Pin Count: 28; Design Item ID: E32-400M30S
U4 U5 U7 U9-U11 = CMP-040-000013-1: Component Type: Standard; Source: 电源模块.SCHLIB; Design Item ID: TLP185GB; Pin Count: 4
U6 = CMP-012-000004-1: Design Item ID: AMS1117; Pin Count: 4; Source: Schlib2.SchLib; Component Type: Standard
U8 = CMP-040-000014-1: Source: 电源模块.SCHLIB; Component Type: Standard; Design Item ID: ULN2803; Pin Count: 18
U12 = CMP-012-000006-1: 3.3V 500mA LDO; Pin Count: 5; Component Type: Standard; Design Item ID: CAT6219-330TD; Source: Schlib2.SchLib
U13 = CMP-040-000002-1: B2424D-1WR2; Source: 电源模块.SCHLIB; Design Item ID: B_D-1WR2; Component Type: Standard; Pin Count: 4
U14 = CMP-012-000014-1: ETH PHY; Pin Count: 25; Component Type: Standard; Design Item ID: LAN8720; Source: Schlib2.SchLib
U15 = CMP-050-000005-1: Source: 主控芯片.SCHLIB; Design Item ID: CH340G; Component Type: Standard; Pin Count: 16
U16 = CMP-031-00008-1: DC DC Step Down IC; Source: Schlib2.SchLib; Pins: 6; Design Item ID: MP2359; Component Type: Standard
U17 = CMP-012-000024-1: W25Q128; Source: Schlib2.SchLib; Component Type: Standard; Pin Count: 8; Design Item ID: W25Q128
U18 = CMP-031-00006-1: EEPROM; Component Type: Standard; Pins: 8; Source: Schlib2.SchLib; Design Item ID: 24C256
U20-U23 = 6N137: 6N137 小封装,HCPL-0600 600 贴片SOP-8,高速TTL兼容光耦 白色小体积
U24 = MCP3204: MCP3204-BI/SL 贴片SOP14
U26 = CMP-068-000006-1: Design Item ID: REF198; Source: Schlib3.SchLib; Component Type: Standard; Pin Count: 8
USB1 = CMP-050-000020-1: Source: 主控芯片.SCHLIB; Component Type: Standard; Pin Count: 5; Design Item ID: USB
Y1 = CMP-012-000026-1: 普通晶振; Published: 8-Jun-2000; LatestRevisionDate: 17-Jul-2002; LatestRevisionNote: Re-released for DXP Platform.; Publisher: Altium Limited; Design Item ID: XTAL-32.768Khz; Component Type: Standard; Source: Schlib2.SchLib
Y2 = CMP-012-000025-1: 3225贴片无源晶振; Component Type: Standard; Design Item ID: XTAL_3225; Source: Schlib2.SchLib
Y3 = CMP-050-000022-1: Source: 主控芯片.SCHLIB; Design Item ID: XTAL_1; Component Type: Standard
Y4 = CMP-003-00030-1: Crystal Oscillator; Published: 8-Jun-2000; LatestRevisionDate: 17-Jul-2002; LatestRevisionNote: Re-released for DXP Platform.; Publisher: Altium Limited; Design Item ID: XTAL; Pins: 2; Component Type: Standard; Source: Schlib2.SchLib
BAT1 = CMP-00029-00001-1: Component Type: Standard; Design Item ID: BAT; Pins: 2; Source: Schlib2.SchLib
C4 C6 C14-C17 C28 C29 C31-C34 C36-C41 C48 C50 C55 C59-C69 C76 C77 = CMP-001-00083-1: Source: Schlib2.SchLib; Design Item ID: CAP; Pins: 2; Component Type: Standard
F1 R1 R7 R9 R17 R20 = CMP-009-00177-1: Pins: 2; Component Type: Standard; Source: Schlib2.SchLib; Design Item ID: RES
R12 R14 R16 R19 R23 R25 R37 R44 R57-R59 = CMP-009-00180-1: Component Type: Standard; Pins: 2; Source: 电源模块.SCHLIB; Design Item ID: RES
RESET1 = CMP-012-000013-1: Design Item ID: KEY_M; Component Type: Standard; Source: Schlib2.SchLib; Pin Count: 2